# EAGLE design knitRider_exp_1_1 (EAGLE 9.0.0)
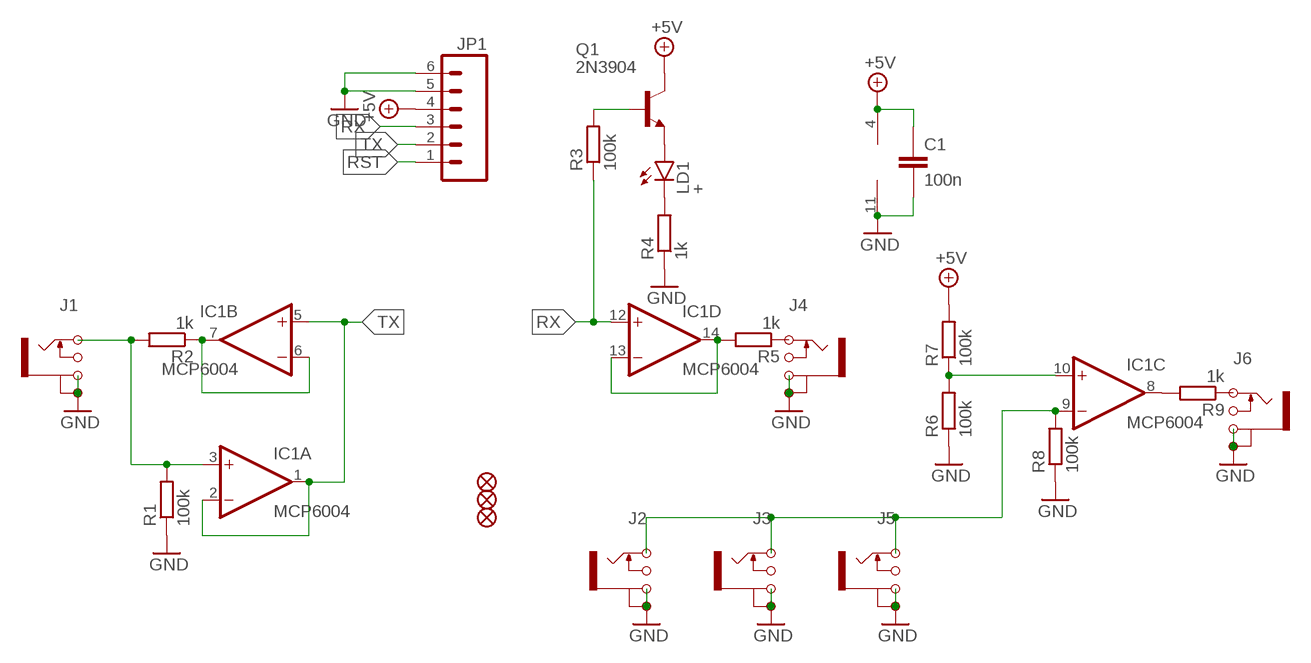
[diagram p0: schematic, sheet 1]

## Parts
C1  100n  CAPACITOR0603  [CAPACITOR0603]
FID1  FIDUCIAL  [FIDUCIAL]
FID2  FIDUCIAL  [FIDUCIAL]
FID3  FIDUCIAL  [FIDUCIAL]
IC1  MCP6004  MCP6004D  [SO14]
J1  JACK_MONOJACK_MONO  [JACK_MONO]
J2  JACK_MONOJACK_MONO  [JACK_MONO]
J3  JACK_MONOJACK_MONO  [JACK_MONO]
J4  JACK_MONOJACK_MONO  [JACK_MONO]
J5  JACK_MONOJACK_MONO  [JACK_MONO]
J6  JACK_MONOJACK_MONO  [JACK_MONO]
JP1  M06LOCK  [1X06_LOCK]
LD1  +  LED_THT  [LEDSMALLHOLES]
Q1  2N3904  [SOT23]
R1  100k  RESISTOR0603  [RESISTOR0603]
R2  1k  RESISTOR0603  [RESISTOR0603]
R3  100k  RESISTOR0603  [RESISTOR0603]
R4  1k  RESISTOR0603  [RESISTOR0603]
R5  1k  RESISTOR0603  [RESISTOR0603]
R6  100k  RESISTOR0603  [RESISTOR0603]
R7  100k  RESISTOR0603  [RESISTOR0603]
R8  100k  RESISTOR0603  [RESISTOR0603]
R9  1k  RESISTOR0603  [RESISTOR0603]

## Nets
+5V: C1.1 IC1.4(P:V+) JP1.4 Q1.C R7.2
GND: C1.2 IC1.11(P:V-) J1.G1 J1.G2 J2.G1 J2.G2 J3.G1 J3.G2 J4.G1 J4.G2 J5.G1 J5.G2 J6.G1 J6.G2 JP1.5 JP1.6 R1.1 R4.1 R6.1 R8.1
N$1: LD1.A Q1.E
N$2: Q1.B R3.2
N$4: J6.T R9.1
N$7: J4.T R5.1
N$9: IC1.6(B:-IN) IC1.7(B:OUT) R2.1
N$10: IC1.9(C:-IN) J2.T J3.T J5.T R8.2
N$15: IC1.10(C:+IN) R6.2 R7.1
N$18: LD1.K(C) R4.2
N$19: IC1.3(A:+IN) J1.T R1.2 R2.2
N$20: IC1.8(C:OUT) R9.2
N$21: IC1.13(D:-IN) IC1.14(D:OUT) R5.2
RST: JP1.1
RX: IC1.12(D:+IN) JP1.3 R3.1
TX: IC1.1(A:OUT) IC1.2(A:-IN) IC1.5(B:+IN) JP1.2
Unconnected: J1.SW J2.SW J3.SW J4.SW J5.SW J6.SW

## Library data of the parts
C1 = BASTL_CAPACITORS:CAPACITOR0603; ASSEMBLED: yes; TYPE: SMT
FID1-FID3 = BASTL_FIDUCIALS:FIDUCIAL; ASSEMBLED: no; TYPE: FID
IC1 = BASTL_ICS:MCP6004: OP AMP; MAN: Microchip; MPN: MCP6004T-I/SL
J1-J6 = BASTL_CONNECTORS:JACK_MONO; ASSEMBLED: yes; ODOO: PJ301BM; TYPE: THT
JP1 = BASTL_PINHEADERS:M06: Header 6 Standard 6-pin 0.1" header. Use with straight break away headers (SKU : PRT-00116), right angle break away headers (PRT-00553), swiss pins (PRT-00743), machine pins (PRT-00117), and female headers (PRT-00115). Molex polarized connector foot print use with SKU : PRT-08094 with associated crimp pins and housings. NOTES ON THE VARIANTS LOCK and LOCK_LONGPADS... This footprint was designed to help hold the alignment of a through-hole component (i.e. 6-pin header) while soldering it into place. You may notice that each hole has been shifted either up or down by 0.005 of an inch from it's more standard position (which is a perfectly straight line). This slight alteration caused the pins (the squares in the middle) to touch the edges of the holes. Because they are alternating, it causes a "brace" to hold the component in place. 0.005 has proven to be the perfect amount of "off-center" position when using our standard breakaway headers. Although looks a little odd when you look at the bare footprint, once you have a header in there, the alteration is very hard to notice. Also,if you push a header all the way into place, it is covered up entirely on the bottom side. This idea of altering the position of holes to aid alignment will be further integrated into the Sparkfun Library for other footprints. It can help hold any component with 3 or more connection pins.
LD1 = BASTL_LEDS:LED_THT: [color]_[diameter]_[difused/clear] R_3mm_D; ASSEMBLED: yes; TYPE: THT
Q1 = BASTL_TRANZISTORS:2N3904; ASSEMBLED: yes; MAN: ON SEMICONDUCTOR; MPN: MMBT3904LT1G; TYPE: SMT
R1-R9 = BASTL_RESISTORS:RESISTOR0603; ASSEMBLED: yes; TYPE: SMT

## Board
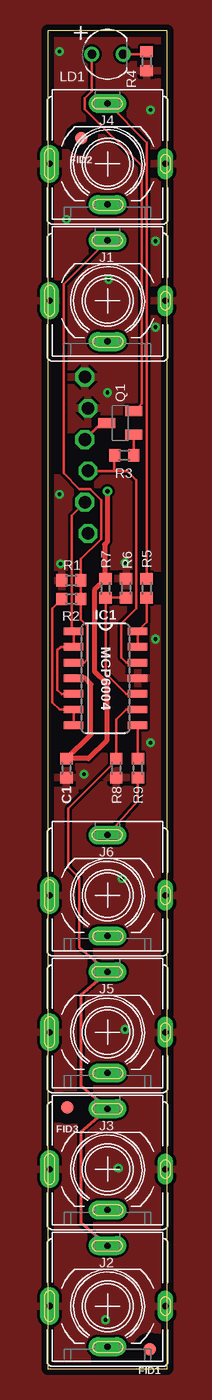
[diagram p1: board, top side]
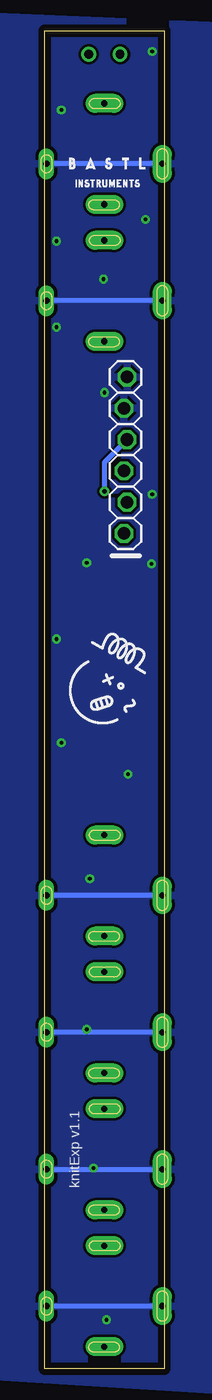
[diagram p2: board, bottom side, seen from below]

Size 9.68 x 108.58 mm. Coordinates in mm from the lower left corner, seen from the top.
Outline: 0,0 9.68,0 9.68,108.58 0,108.58 0,0
Copper layers (1*16): Top 0.035mm / dielectric 1.5mm / Bottom 0.035mm
Design rules "default *": minimum track width 8mil, minimum drill 24mil, track to track 8mil, track to pad 8mil, pad to pad 8mil, via to via 8mil, smd to smd 8mil, copper to edge 20mil, drill to drill 8mil, minimum pad ring 10mil, minimum via ring 8mil, stop-mask expansion 4mil, vias tented up to drill 0mil, thermal gap 10mil

### Footprints (pad centres in the part's own frame; a part is rotated, then mirrored left to right if it is on the bottom)
CAPACITOR0603 = smd 0.9 x 1: 1 -0.771,0; 2 0.771,0
FIDUCIAL = smd 1 x 1: 2 0,0
SO14 = smd 0.6 x 1.6: 1 -3.81,-2.6; 2 -2.54,-2.6; 3 -1.27,-2.6; 4 0,-2.6; 5 1.27,-2.6; 6 2.54,-2.6; 7 3.81,-2.6; 8 3.81,2.6; 9 2.54,2.6; 10 1.27,2.6; 11 0,2.6; 12 -1.27,2.6; 13 -2.54,2.6; 14 -3.81,2.6
JACK_MONO = drill 0.5 pad 1.524 long: G1 -4.7,0; SW 0,-3.3; T 0,4.9 | drill 0.5 pad 1.27 long: G2 4.7,0
1X06_LOCK = drill 1.016 octagon: 1 0,0; 2 2.54,-0.254; 3 5.08,0; 4 7.62,-0.254; 5 10.16,0; 6 12.7,-0.254
LEDSMALLHOLES = drill 0.7 pad 1.143: A -1.27,0; K 1.27,0
SOT23 = smd 0.8 x 1.4: B -0.95,-1.1; C 0,1.1; E 0.95,-1.1
RESISTOR0603 = smd 0.9 x 1: 1 -0.771,0; 2 0.771,0

### Placement (x,y rotation side)
C1  1.51,48.74 270 top
FID1  8.25,1.59 0 top
FID2  2.7,99.85 0 top
FID3  1.59,21.19 0 top
IC1  4.68,56.04 270 top
J1  4.84,86.68 0 top
J2  4.84,5.08 0 top
J3  4.84,16.19 0 top
J4  4.84,97.79 0 top
J5  4.84,27.3 0 top
J6  4.84,38.42 0 top
JP1  3.25,67.79 90 bottom
LD1  4.84,106.68 0 top
Q1  5.87,76.76 90 top
R1  1.91,63.98 0 top
R2  1.91,62.47 0 top
R3  6.19,74.14 0 top
R4  8.02,106.12 90 top
R5  8.02,63.34 270 top
R6  6.35,63.34 270 top
R7  4.68,63.34 90 top
R8  5.56,48.74 90 top
R9  7.3,48.74 90 top
U$1  [BASTL_HLAVA_1]  7.7,52.31 0 bottom
U$2  [BASTL_LOGO_1]  7.7,95.88 0 bottom

### Tracks (layer width: path | path; a pad name or v marks a point on that pad's centre or on a via)
+5V  (via drill 0.35)
  Top 0.203: 4.93,76.6 4.81,76.72 | 4.81,76.72 Q1.C | 4.32,76.72 4.81,76.72
  Top 0.254: Q1.C 4.35,76.76 JP1.4
  Top 0.406: v4.83,71.21 4.83,67.13 4.6,66.91 4.6,64.19 R7.2 4.68,64.1 3.78,63.19 3.78,56.62 4.76,55.64 4.76,50.96 3.31,49.51 C1.1 3.49,51.49 3.49,55.56 3.02,56.04 IC1.4
  Bottom 0.406: v4.83,71.21 4.83,73.58 JP1.4
GND  (via drill 0.3)
  Bottom 0.406: J1.G1 J1.G2 | J4.G1 J4.G2 | J6.G1 J6.G2 | J5.G1 J5.G2 | J3.G2 J3.G1 | J2.G1 J2.G2
  other vias: 2.94,48.26 8.33,50.8 8.73,59.21 6.27,65.41 1.03,65.33 4.84,79.22 4.92,88.42 8.73,91.52 8.73,84.53 8.33,102.16 0.95,106.92 1.51,93.27 0.95,70.96 6.03,39.77 6.27,27.54 5.71,16.27 4.68,3.97
  pour Bottom: -6.59,-1.91 13.73,-0.64 15.64,109.85 -6.59,108.9
  pour Top: -8.49,-3.49 13.41,-3.49 13.41,112.39 -8.49,112.39
N$1
  Top 0.203: LD1.A 3.57,103.69 3.01,103.13 3.01,102.24 7.61,97.64 7.61,78.34 Q1.E
N$2
  Top 0.203: Q1.B 6.97,74.15 R3.2
N$4
  Top 0.203: J6.T 7.3,46.1 R9.1
N$7
  Top 0.203: R5.1 8.02,99.52 J4.T
N$9
  Top 0.203: IC1.7 IC1.6 0.95,53.5 0.37,54.08 0.37,61.71 R2.1
N$10
  Top 0.203: J5.T 2.54,34.19 2.54,39.85 1.67,40.72 1.67,45.46 5.56,49.35 R8.2 5.56,52.71 6.35,53.5 IC1.9
  Top 0.254: J5.T 2.67,30.35 2.67,22.95 J3.T 2.67,19.24 2.67,11.83 J2.T
N$15
  Top 0.203: R6.2 R7.1 4.68,56.44 6.35,54.77 IC1.10
N$18
  Top 0.203: LD1.K 7.8,106.68 R4.2
N$19
  Top 0.203: J1.T 1.27,88.01 1.27,72.68 2.56,71.39 3.44,71.39 4.32,70.51 4.32,67.34 2.68,65.7 R1.2 R2.2 2.68,60.79 3.19,60.28 3.19,57.56 2.94,57.31 IC1.3
N$20
  Top 0.203: R9.2 7.3,52.21 IC1.8
N$21
  Top 0.203: R5.2 8.02,60.58 IC1.14 IC1.13
RX
  Top 0.203: IC1.12 6.35,57.31 5.95,57.71 5.95,60.48 7.15,61.69 7.15,72.14 6.43,72.87 5.4,72.87 | JP1.3 5.4,72.87 | R3.1 5.4,74.11 5.4,72.87
TX
  Top 0.203: IC1.5 1.11,54.77 0.78,55.1 0.78,58.32 1.03,58.58 IC1.2 IC1.1 1.92,60.01 1.92,69.25 JP1.2

### Text on the board
bPlace: knitExp v1.1